# Altium schematic sheet Main.SchDoc
size 209 x 297 mm; Author: Мурашкин Д.В.; Address1: Address1; Address2: Address2; Address3: Address3; Address4: Address4; DocumentNumber: АБВГ.123456.001 Э3; Scale: 1:1; Letter1Column: Э; PartName: Деталь; DocumentName: 2
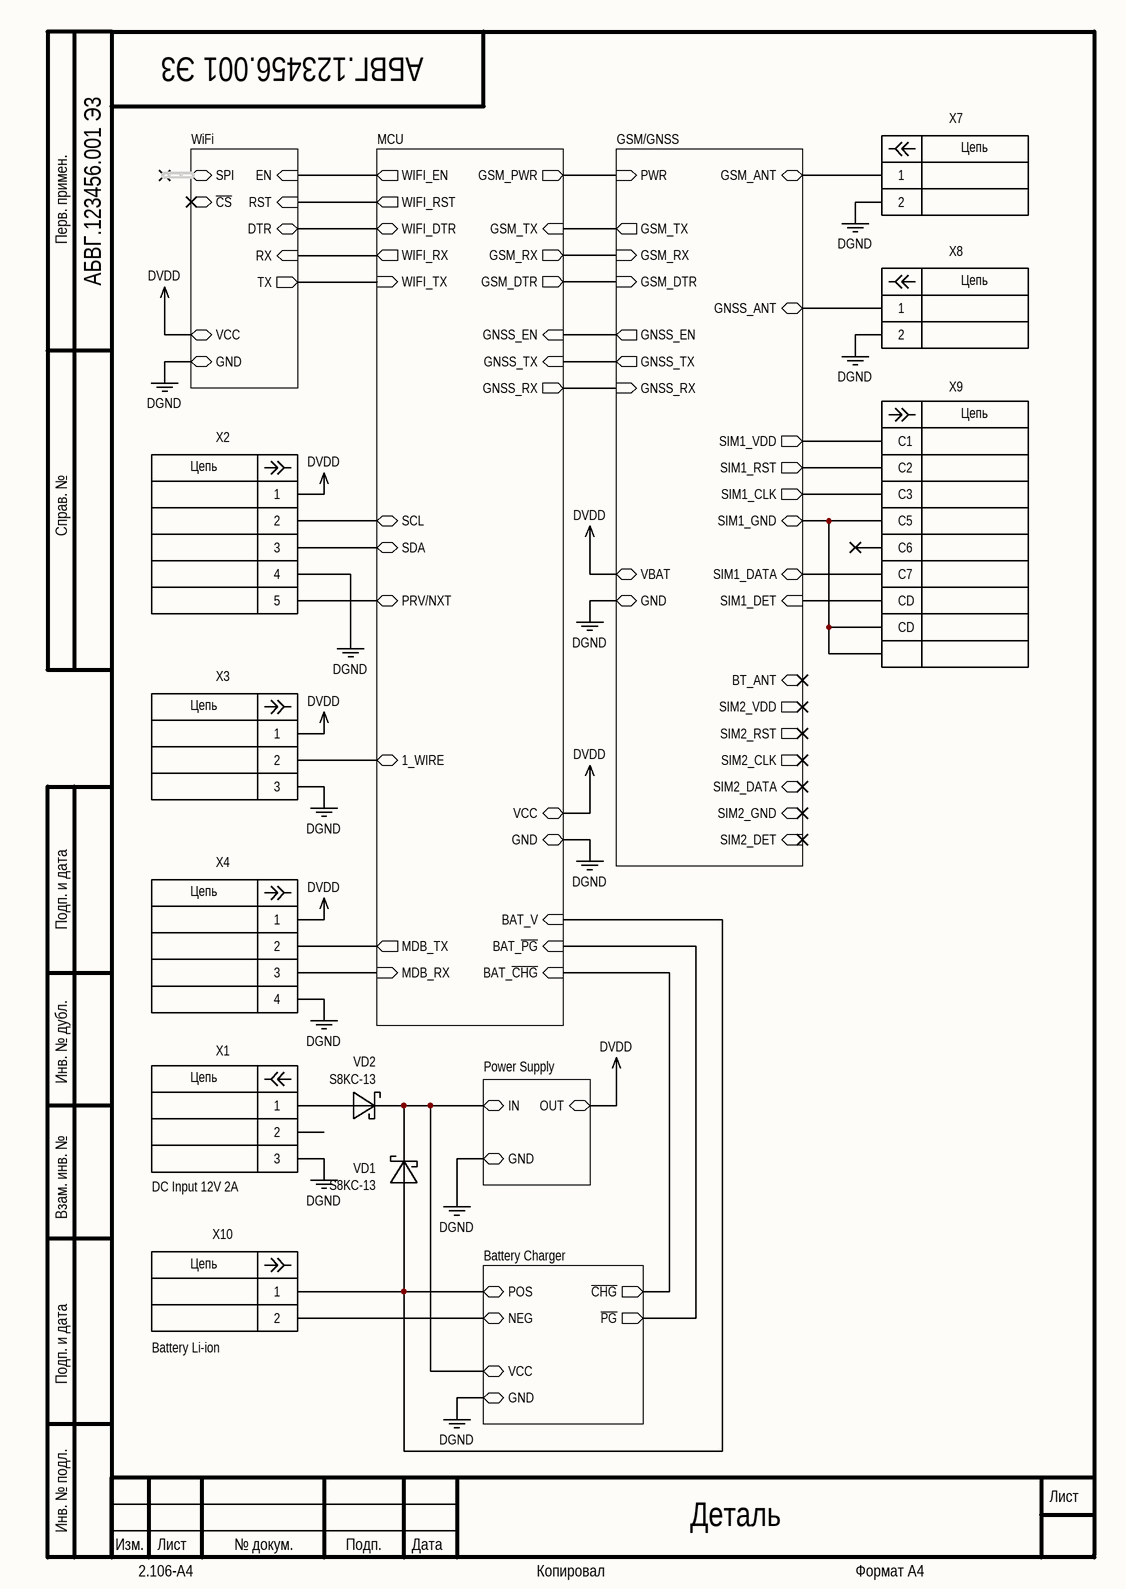
[diagram p0: Main.SchDoc]

## Parts
VD1  S8KC-13  [DO-214AB]
VD2  S8KC-13  [DO-214AB]
X1  PJ-002A  [PJ-002A]  (value not drawn)
X2  S5B-XH-A  [S5B-XH-A]  (value not drawn)
X3  S3B-XH-A  [S3B-XH-A]  (value not drawn)
X4  *  [S4B-XH-A]  (value not drawn)
X7  HYR-1141  [HYR-1141]  (value not drawn)
X8  HYR-1141  [HYR-1141]  (value not drawn)
X9  47553-0001  [47553-0001]  (value not drawn)
X10  *  [B2B-XH-A]  (value not drawn)

## Sub-sheets
Battery Charger = Battery Charger.SchDoc: VCC, NEG, ~{PG} (out), GND, ~{CHG} (out), POS
GSM/GNSS = GSM GNSS Module.SchDoc: VBAT, GND, PWR (in), SIM1_CLK (out), SIM1_RST (out), GSM_DTR (in), GSM_ANT, GNSS_RX (in), GNSS_EN (out), GNSS_TX (out), GSM_RX (in), GSM_TX (out), SIM1_DET (in), SIM1_GND, SIM1_DATA (bidir), GNSS_ANT, SIM1_VDD (out), BT_ANT, SIM2_VDD (out), SIM2_RST (out), SIM2_CLK (out), SIM2_DATA (bidir), SIM2_GND, SIM2_DET (in)
MCU = MCU.SchDoc: PRV/NXT (bidir), SDA (bidir), SCL (bidir), 1_WIRE (bidir), MDB_TX (out), MDB_RX (in), WIFI_EN (out), WIFI_RST (out), WIFI_RX (out), WIFI_TX (in), WIFI_DTR (bidir), GSM_PWR (out), GSM_TX (in), GSM_RX (out), GSM_DTR (out), GNSS_EN (in), GNSS_TX (in), GNSS_RX (out), BAT_~{CHG} (in), BAT_~{PG} (in), BAT_V (in), GND, VCC
Power Supply = Power supply.SchDoc: IN, GND, OUT
WiFi = WiFi.SchDoc: EN (in), VCC, GND, RST (in), DTR (bidir), RX (in), TX (out), SPI (harness SPI), ~{CS} (bidir)

## Nets
DGND: X1.3 X2.4 X3.3 X4.4 X7.2 X8.2 ; sheet Power Supply/GND, sheet Battery Charger/GND, sheet WiFi/GND, sheet GSM/GNSS/GND, sheet MCU/GND
DVDD: X2.1 X3.1 X4.1 ; sheet Power Supply/OUT, sheet WiFi/VCC, sheet GSM/GNSS/VBAT, sheet MCU/VCC
NetVD1_1: VD1.1(Anode) X10.1 ; sheet Battery Charger/POS, sheet MCU/BAT_V
NetVD1_2: VD1.2(Cathode) VD2.2(Cathode) ; sheet Power Supply/IN, sheet Battery Charger/VCC
NetVD2_1: VD2.1(Anode) X1.1
NetX2_2: X2.2 ; sheet MCU/SCL
NetX2_3: X2.3 ; sheet MCU/SDA
NetX2_5: X2.5 ; sheet MCU/PRV/NXT
NetX3_2: X3.2 ; sheet MCU/1_WIRE
NetX4_2: X4.2 ; sheet MCU/MDB_TX
NetX4_3: X4.3 ; sheet MCU/MDB_RX
NetX7_1: X7.1 ; sheet GSM/GNSS/GSM_ANT
NetX8_1: X8.1 ; sheet GSM/GNSS/GNSS_ANT
NetX9_C1: X9.C1 ; sheet GSM/GNSS/SIM1_VDD
NetX9_C2: X9.C2 ; sheet GSM/GNSS/SIM1_RST
NetX9_C3: X9.C3 ; sheet GSM/GNSS/SIM1_CLK
NetX9_C5: X9.C5 X9.CASE X9.CD2(CD) ; sheet GSM/GNSS/SIM1_GND
NetX9_C7: X9.C7 ; sheet GSM/GNSS/SIM1_DATA
NetX9_CD1: X9.CD1(CD) ; sheet GSM/GNSS/SIM1_DET
NetX10_2: X10.2 ; sheet Battery Charger/NEG
(unnamed): sheet Battery Charger/~{PG}, sheet MCU/BAT_~{PG}
(unnamed): sheet Battery Charger/~{CHG}, sheet MCU/BAT_~{CHG}
(unnamed): sheet WiFi/EN, sheet MCU/WIFI_EN
(unnamed): sheet WiFi/RST, sheet MCU/WIFI_RST
(unnamed): sheet WiFi/DTR, sheet MCU/WIFI_DTR
(unnamed): sheet WiFi/RX, sheet MCU/WIFI_RX
(unnamed): sheet WiFi/TX, sheet MCU/WIFI_TX
(unnamed): sheet GSM/GNSS/PWR, sheet MCU/GSM_PWR
(unnamed): sheet GSM/GNSS/GSM_DTR, sheet MCU/GSM_DTR
(unnamed): sheet GSM/GNSS/GNSS_RX, sheet MCU/GNSS_RX
(unnamed): sheet GSM/GNSS/GNSS_EN, sheet MCU/GNSS_EN
(unnamed): sheet GSM/GNSS/GNSS_TX, sheet MCU/GNSS_TX
(unnamed): sheet GSM/GNSS/GSM_RX, sheet MCU/GSM_RX
(unnamed): sheet GSM/GNSS/GSM_TX, sheet MCU/GSM_TX

Not connected (* = marked no-connect by the designer): X1 2; X9 C6*

## Notes on the sheet
- (near X1) DC Input 12V 2A
- (near X10) Battery Li-ion
- Перв. примен.
- Справ. №
- Подп. и дата
- Инв. № дубл.
- Взам. инв. №
- Инв. № подл.
- Изм.
- Лист
- № докум.
- Подп.
- Дата
- 2.106-A4
- Копировал
- Формат А4
- (in symbol 47553-0001) Цепь
- (in symbol B2B-XH-A) Цепь
- (in symbol HYR-1141) Цепь
- (in symbol PJ-002A) Цепь
- (in symbol S3B-XH-A) Цепь
- (in symbol S4B-XH-A) Цепь
- (in symbol S5B-XH-A) Цепь

## Library data of the parts
VD1 VD2 = S8KC-13: Diode Schottky 8A 800V; Manufacturer: ON Semiconductor; Group: Diodes - Rectifiers - Single; Package: DO-214AB; Part name: S8KC-13
X1 = PJ-002A: Power Jack, DC; Manufacturer: CUI; Group: Barrel - Power Connectors; Short description: CONN POWER JACK 2.1MM; Package: 2.1mm ID, 5.5mm OD; Distributor: Digi-Key; Part name: PJ-002A
X2 = S5B-XH-A: Header 2.54 5p Right; Manufacturer: JST Sales America Inc; Part name: S3B-XH-A(LF)(SN); Group: Rectangular Connectors - Headers, Male Pins; Package: 3 DIP 2.54
X3 = S3B-XH-A: Header, 2.54, 3p, Right; Manufacturer: JST Sales America Inc; Part name: S3B-XH-A(LF)(SN); Group: Rectangular Connectors - Headers, Male Pins; Short description: CONN HEADER XH RIGHT ANGLE 3POS 2.5MM; Package: 3 DIP 2.54; Distributor: Digi-Key
X4 = S4B-XH-A: Header 2.54 4p Right; Manufacturer: JST Sales America Inc; Part name: S3B-XH-A(LF)(SN); Group: Rectangular Connectors - Headers, Male Pins; Package: 3 DIP 2.54
X7 X8 = HYR-1141: SMA Jack, TH Right; Manufacturer: HOYUTEC; Group: Coaxial Connectors (RF); Short description: CONN SMA TH R; Package: HYR-1141; Part name: HYR-1141; Datasheet: http://www.hoyutec.com.tw/product-detail.php?id=260; Distributor MCS: http://www.chipdip.ru/product/gsa-1141/
X9 = 47553-0001: SIM card connector; Manufacturer: Molex; Group: Memory Connectors - PC Card Sockets; Package: 19.35 x 26.30mm; Part name: 47553-0001; Short description: SIM card connector; Datasheet: http://www.molex.com/molex/products/datasheet.jsp?part=active/0475530001_MEMORY_CARD_SOCKET.xml; Distributor MSC: https://www.terraelectronica.ru/catalog_info.php?CODE=317680
X10 = B2B-XH-A: Header, 2.54, 2p, Top; Manufacturer: JST Sales America Inc; Part name: B2B-XH-A(LF)(SN); Group: Rectangular Connectors - Headers, Male Pins; Short description: CONN HEADER XH TOP 2POS 2.5MM; Package: 2 DIP 2.54; Distributor: Digi-Key